# EAGLE schematic Day light emulate for birds unrouted (EAGLE 6.1)
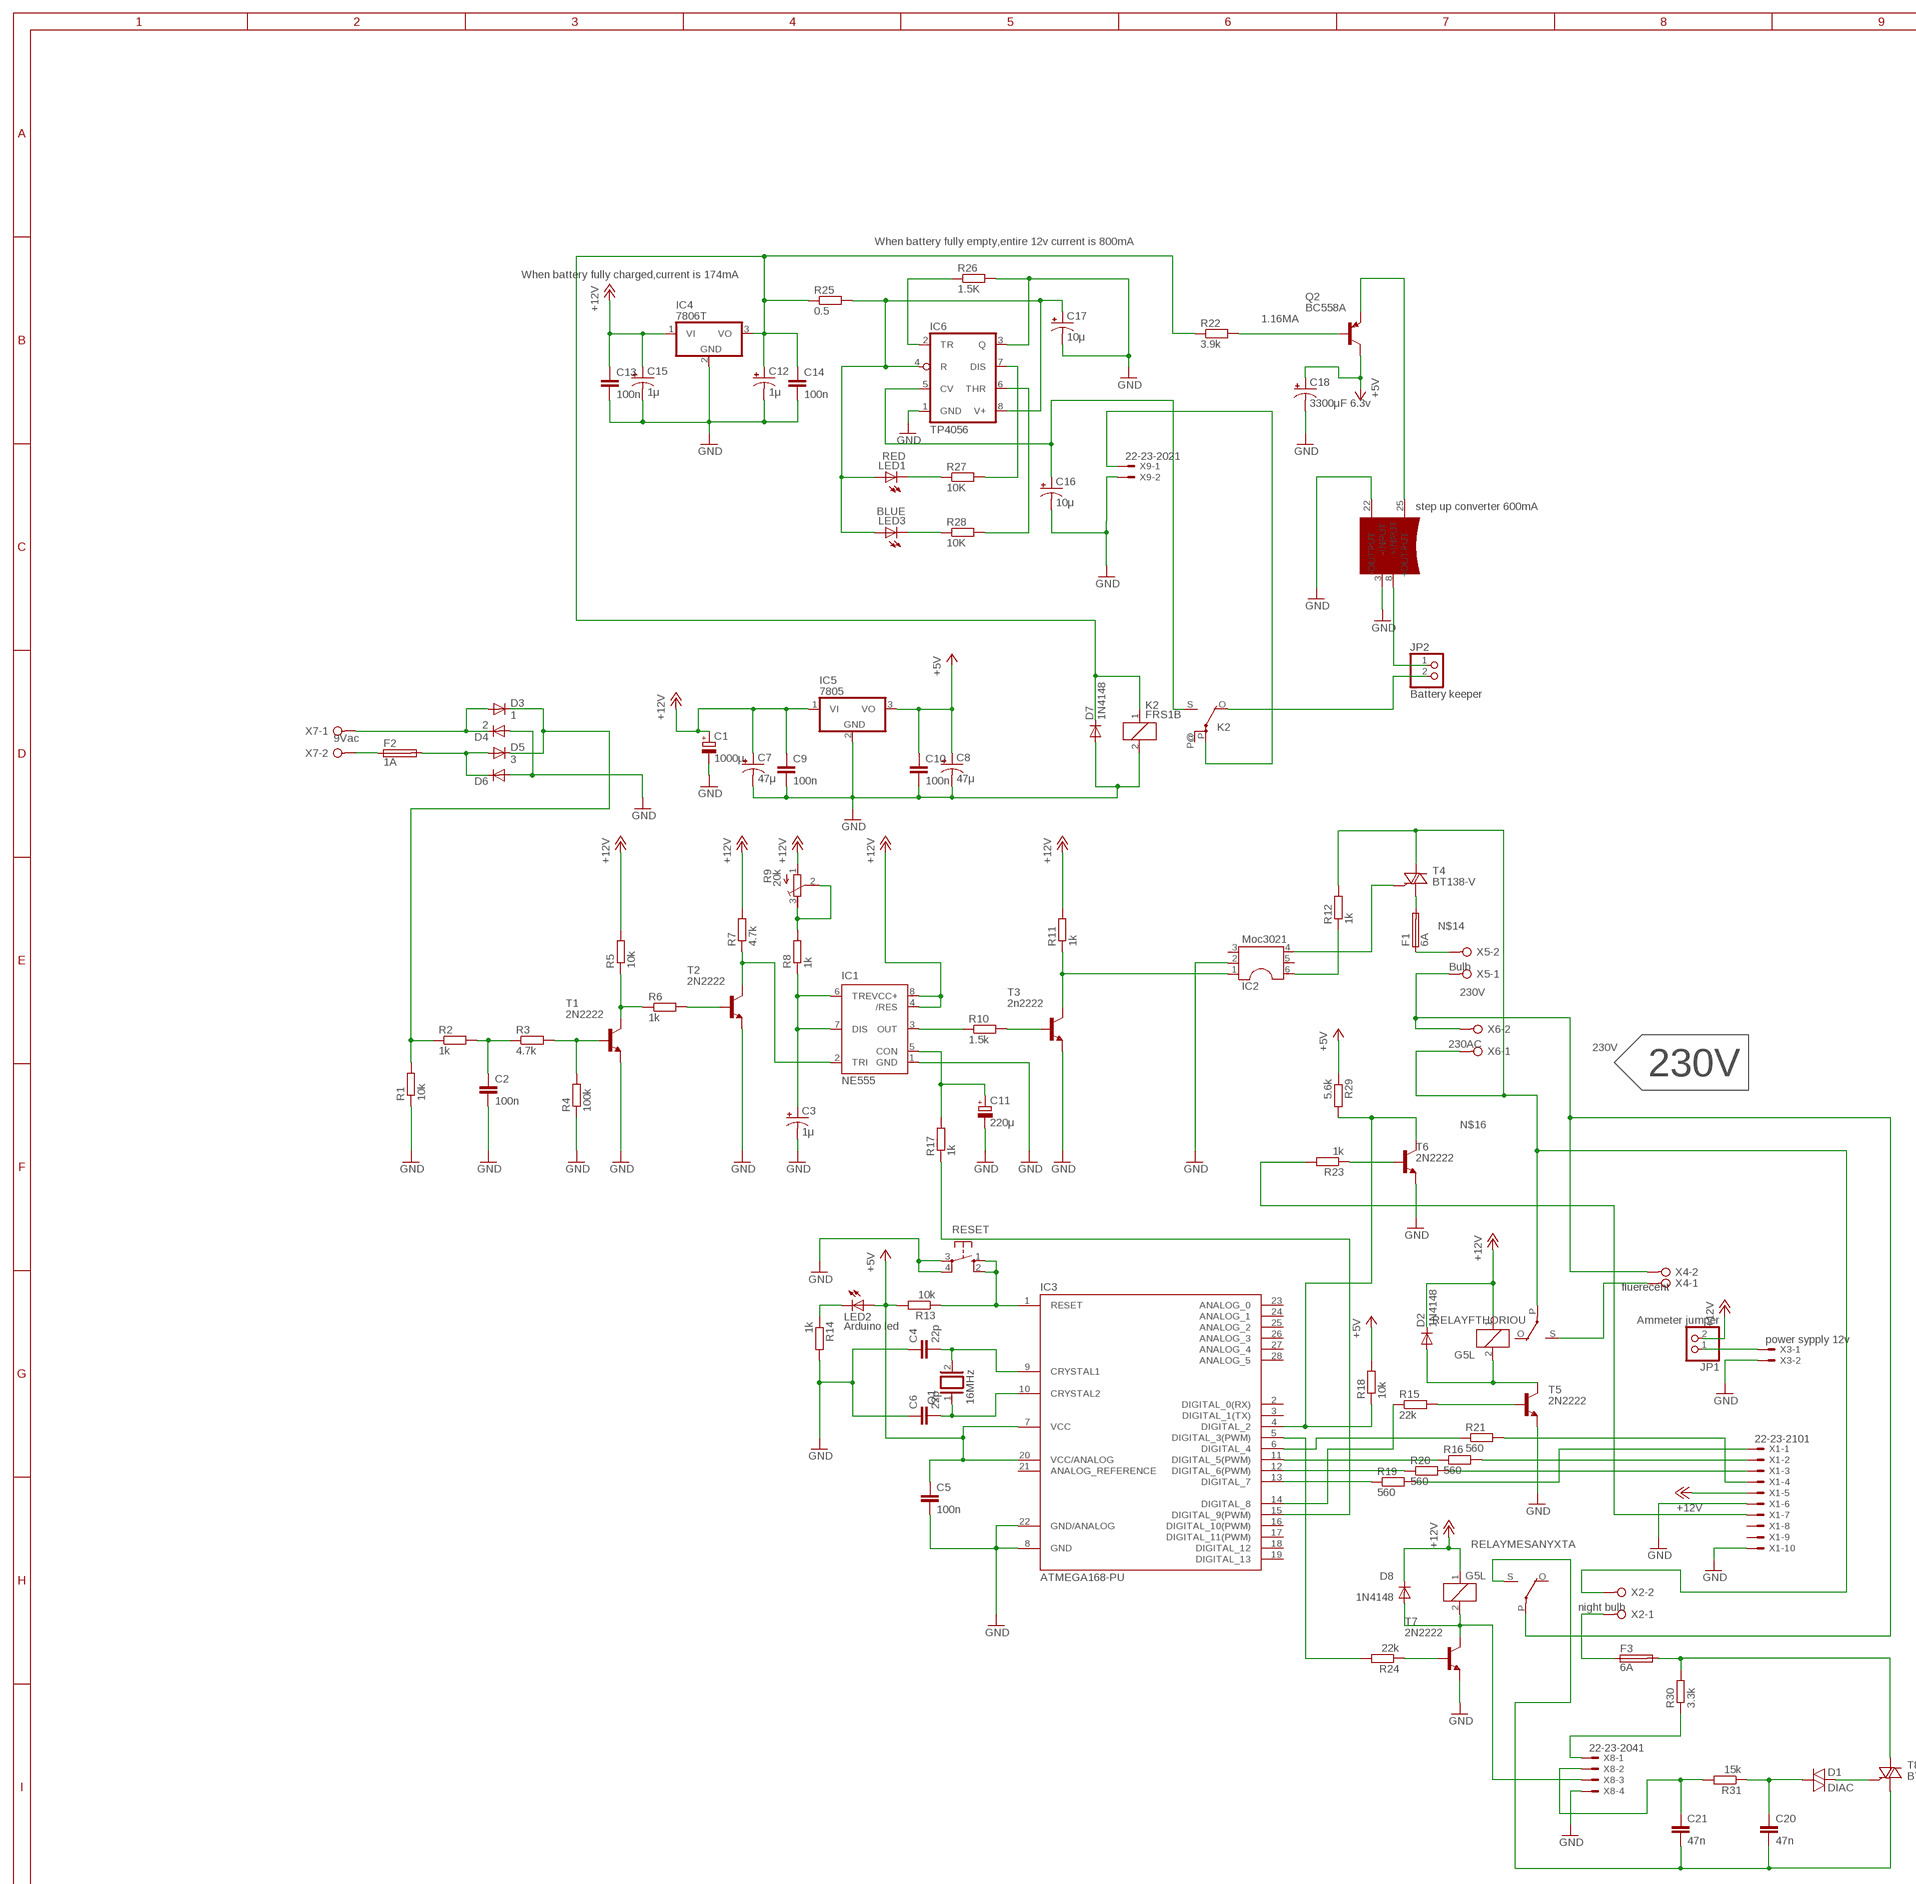
[diagram p0: schematic, sheet 1, part 1 of 2]
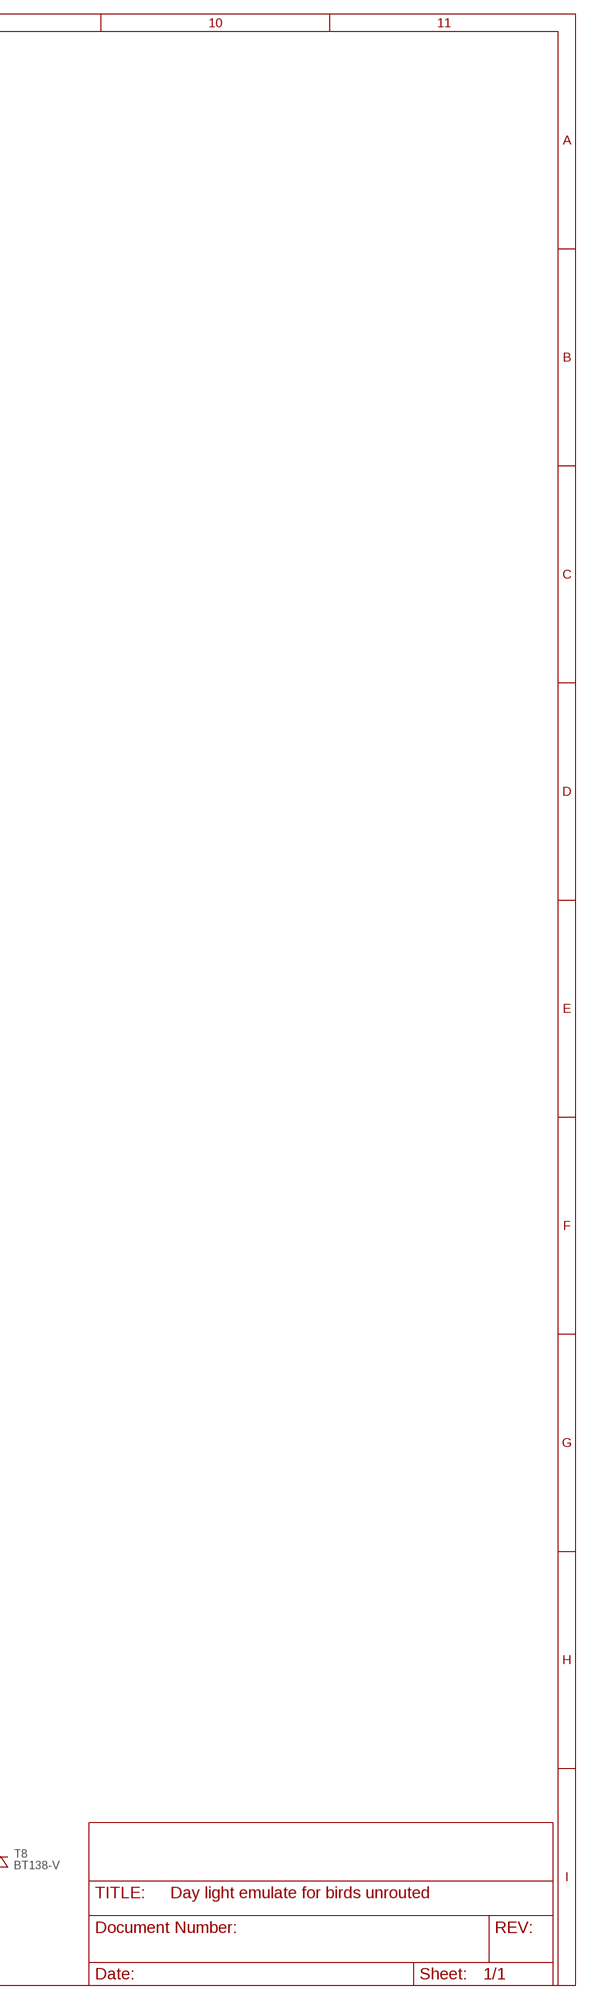
[diagram p1: schematic, sheet 1, part 2 of 2]

## Parts
C1  1000μ  CPOL-EUE5-13  [E5-13]
C2  100n  C-EU025-030X050  [C025-030X050]
C3  1μ  CPOL-USE2-4  [E2-4]
C4  22p  C-EU025-030X050  [C025-030X050]
C5  100n  C-EU025-030X050  [C025-030X050]
C6  22p  C-EU025-030X050  [C025-030X050]
C7  47μ  CPOL-USE2-4  [E2-4]
C8  47μ  CPOL-USE2-4  [E2-4]
C9  100n  C-EU025-030X050  [C025-030X050]
C10  100n  C-EU025-030X050  [C025-030X050]
C11  220μ  CPOL-EUE5-10.5  [E5-10,5]
C12  1μ  CPOL-USE2-4  [E2-4]
C13  100n  C-EU025-030X050  [C025-030X050]
C14  100n  C-EU025-030X050  [C025-030X050]
C15  1μ  CPOL-USE2-4  [E2-4]
C16  10μ  CPOL-USE2-4  [E2-4]
C17  10μ  CPOL-USE2-4  [E2-4]
C18  3300μF 6.3v  CPOL-USE5-6  [E5-6]
C20  47n  C-EU025-030X050  [C025-030X050]
C21  47n  C-EU025-030X050  [C025-030X050]
D1  DIAC  DIAC-GT32  [GT32]
D2  1N4148  [DO35-10]
D3  1  1N4004  [DO41-10]
D4  2  1N4004  [DO41-10]
D5  3  1N4004  [DO41-10]
D6  1N4004  [DO41-10]
D7  1N4148  [DO35-10]
D8  1N4148  [DO35-10]
F1  6A  FUSESHK20L  [SHK20L]
F2  1A  FUSESHK20L  [SHK20L]
F3  6A  FUSESHK20L  [SHK20L]
IC1  NE555  [DIL-08]
IC2  Moc3021  DIL6  [DIL06]
IC3  ATMEGA168-PU  [DIL28-3]
IC4  7806T  [TO220H]
IC5  7805  7805TV  [TO220V]
IC6  TP4056  LM555D  [SO08]
JP1  Ammeter jumper  PINHD-1X2  [1X02]
JP2  Battery keeper  PINHD-1X2  [1X02]
K2  FRS1B  [FRS1B]
LED1  RED  LED3MM  [LED3MM]
LED2  Arduino led  LED3MM  [LED3MM]
LED3  BLUE  LED3MM  [LED3MM]
Q1  16MHz  XTAL/S  [QS]
Q2  BC558A  [TO92-EBC]
R1  10k  R-EU_0207/10  [0207/10]
R2  1k  R-EU_0207/10  [0207/10]
R3  4.7k  R-EU_0207/10  [0207/10]
R4  100k  R-EU_0207/10  [0207/10]
R5  10k  R-EU_0207/10  [0207/10]
R6  1k  R-EU_0207/10  [0207/10]
R7  4.7k  R-EU_0207/10  [0207/10]
R8  1k  R-EU_0207/10  [0207/10]
R9  20k  R-TRIMM3339P  [RTRIM3339P]
R10  1.5k  R-EU_0207/10  [0207/10]
R11  1k  R-EU_0207/10  [0207/10]
R12  1k  R-EU_0207/10  [0207/10]
R13  10k  R-EU_0207/10  [0207/10]
R14  1k  R-EU_0207/10  [0207/10]
R15  22k  R-EU_0207/10  [0207/10]
R16  560  R-EU_0207/10  [0207/10]
R17  1k  R-EU_0207/10  [0207/10]
R18  10k  R-EU_0207/10  [0207/10]
R19  560  R-EU_0207/10  [0207/10]
R20  560  R-EU_0207/10  [0207/10]
R21  560  R-EU_0207/10  [0207/10]
R22  3.9k  R-EU_0207/10  [0207/10]
R23  1k  R-EU_0207/10  [0207/10]
R24  22k  R-EU_0207/10  [0207/10]
R25  0.5  R-EU_0207/10  [0207/10]
R26  1.5K  R-EU_0207/10  [0207/10]
R27  10K  R-EU_0207/10  [0207/10]
R28  10K  R-EU_0207/10  [0207/10]
R29  5.6k  R-EU_0207/10  [0207/10]
R30  3.3k  R-EU_0207/10  [0207/10]
R31  15k  R-EU_0207/10  [0207/10]
RELAYFTHORIOU  G5L  [G5LE]
RELAYMESANYXTA  G5L  [G5LE]
RESET  10-XX  [B3F-10XX]
STEPUP1  steup converter 600mA  STEP_UP_CONVERTER_600MA  [STEPUP_CONVERTER_600MA]
T1  2N2222  [TO18]
T2  2N2222  [TO18]
T3  2n2222  2N2222  [TO18]
T4  BT138-V  [TO220BV]
T5  2N2222  [TO18]
T6  2N2222  [TO18]
T7  2N2222  [TO18]
T8  BT138-V  [TO220BV]
X1  22-23-2101  [22-23-2101]
X2  night bulb  W237-02P  [W237-132]
X3  power sypply 12v  22-23-2021  [22-23-2021]
X4  fluerecent  W237-02P  [W237-132]
X5  Bulb  W237-02P  [W237-132]
X6  230AC  W237-02P  [W237-132]
X7  9Vac  W237-02P  [W237-132]
X8  22-23-2041  [22-23-2041]
X9  22-23-2021  [22-23-2021]

## Nets
1.16MA: Q2.B R22.2
230V: RELAYMESANYXTA.P(2:P) X4.2 X5.1 X6.2
+5V: C5.1 C8.+ C10.1 C18.+ IC3.7(VCC) IC3.20(VCC/ANALOG) IC5.3(VO) LED2.A Q2.C R13.2 R18.2 R29.1
+12V: C1.+ C7.+ C9.1 C13.1 C15.+ D2.C D8.C IC1.4(/RES) IC1.8(VCC+) IC4.1(VI) IC5.1(VI) JP1.2 R5.2 R7.2 R9.1(E) R11.2 RELAYFTHORIOU.1 RELAYMESANYXTA.1 X1.5
GND: C1.- C2.2 C3.- C4.1 C5.2 C6.1 C7.- C8.- C9.2 C10.2 C11.- C12.- C13.2 C14.2 C15.- C16.- C17.- C18.- D4.A D6.A D7.A IC1.1(GND) IC2.2 IC3.8(GND) IC3.22(GND/ANALOG) IC4.2(GND) IC5.2(GND) IC6.1(GND) IC6.3(Q) K2.2 R1.1 R4.1 R14.2 R26.2 RESET.3(P) RESET.4(P1) STEPUP1.3(-INPUT) STEPUP1.22(-OUTPUT) T1.1(E) T2.1(E) T3.1(E) T5.1(E) T6.1(E) T7.1(E) X1.6 X1.10 X3.2 X8.4 X9.2
MORNING: R19.2 X1.1
N$1: IC3.11(DIGITAL_5(PWM)) R16.1
N$2: C2.1 R2.2 R3.1
N$3: R3.2 R4.2 T1.2(B)
N$4: R5.1 R6.1 T1.3(C)
N$5: R6.2 T2.2(B)
N$6: IC1.2(TRI) R7.1 T2.3(C)
N$7: R8.2 R9.2(S) R9.3(A)
N$8: IC1.3(OUT) R10.1
N$9: C3.+ IC1.6(TRE) IC1.7(DIS) R8.1
N$10: R10.2 T3.2(B)
N$11: IC2.1 R11.1 T3.3(C)
N$12: IC2.6 R12.1
N$13: IC2.4 T4.G
N$14: F1.1A X5.2
N$15: JP2.1 STEPUP1.8(+INPUT)
N$16 [230v]: R12.2 RELAYFTHORIOU.P(2:P) T4.T2(A2) X2.2 X6.1
N$17: F2.1A X7.2
N$18: IC3.1(RESET) R13.1 RESET.1(S) RESET.2(S1)
N$19: LED2.K(C) R14.1
N$20: D1.2 T8.G
N$21: C6.2 IC3.10(CRYSTAL2) Q1.1
N$22: C4.2 IC3.9(CRYSTAL1) Q1.2
N$23: IC3.14(DIGITAL_8) R15.1
N$24: R15.2 T5.2(B)
N$25: D2.A RELAYFTHORIOU.2 T5.3(C)
N$26: IC3.13(DIGITAL_7) R19.1
N$27: C11.+ IC1.5(CON) R17.2
N$28: R16.2 X1.2
N$29: IC3.15(DIGITAL_9(PWM)) R17.1
N$30: IC3.6(DIGITAL_4) R21.1
N$31: R21.2 X1.4
N$32: RELAYFTHORIOU.S(2:S) X4.1
N$33: IC3.12(DIGITAL_6(PWM)) R20.1
N$34: D3.A D4.C X7.1
N$35: D5.A D6.C F2.2A
N$36: D3.C D5.C R1.2 R2.1
N$37: R20.2 X1.3
N$38: K2.P(2:P) X9.1
N$39: JP2.2 K2.O(2:O)
N$40: C12.+ C14.1 D7.C IC4.3(VO) K2.1 R22.1 R25.1
N$41: IC3.5(DIGITAL_3(PWM)) R24.2
N$42: R24.1 T7.2(B)
N$43: D8.A RELAYMESANYXTA.2 T7.3(C) X8.3
N$44: C20.2 C21.2 RELAYMESANYXTA.S(2:S) T8.T1(A1)
N$45: Q2.E STEPUP1.25(+OUTPUT)
N$46: C17.+ IC6.4(R) IC6.8(V+) LED1.A LED3.A R25.2
N$47: IC6.7(DIS) R27.2
N$48: IC6.6(THR) R28.2
N$49: C16.+ IC6.5(CV) K2.S(2:S)
N$50: LED1.K(C) R27.1
N$51: IC6.2(TR) R26.1
N$52: LED3.K(C) R28.1
N$53: JP1.1 X3.1
N$54: R23.2 X1.7
N$55: R23.1 T6.2(B)
N$56: IC3.4(DIGITAL_2) R18.1 R29.2 T6.3(C)
N$57: C20.1 D1.1 R31.1
N$58: C21.1 R31.2 X8.2
N$59: R30.1 X8.1
N$60: F3.1A X2.1
N$61: F3.2A R30.2 T8.T2(A2)
N$62: F1.2A T4.T1(A1)
Unconnected: IC2.3 IC2.5 IC3.2(DIGITAL_0(RX)) IC3.3(DIGITAL_1(TX)) IC3.16(DIGITAL_10(PWM)) IC3.17(DIGITAL_11(PWM)) IC3.18(DIGITAL_12) IC3.19(DIGITAL_13) IC3.21(ANALOG_REFERENCE) IC3.23(ANALOG_0) IC3.24(ANALOG_1) IC3.25(ANALOG_2) IC3.26(ANALOG_3) IC3.27(ANALOG_4) IC3.28(ANALOG_5) K2.P@(2:P) RELAYFTHORIOU.O(2:O) RELAYMESANYXTA.O(2:O) X1.8 X1.9

## Library data of the parts
C1 C11 = rcl:CPOL-EU: POLARIZED CAPACITOR, European symbol
C2 C4-C6 C9 C10 C13 C14 C20 C21 = rcl:C-EU: CAPACITOR, European symbol
C3 C7 C8 C12 C15-C18 = rcl:CPOL-US: POLARIZED CAPACITOR, American symbol
D1 = diode:DIAC-: DIAC
D2 D7 D8 = diode:1N4148: DIODE high speed (Philips)
D3-D6 = diode:1N4004: DIODE general purpose rectifier, 1 A
F1-F3 = fuse:FUSE: Fuse
IC1 = st-microelectronics:NE555: General purpose bipolar Timer
IC2 = ic-package:DIL6: Dual In Line / Socket
IC3 = Arduino-AVR:ATMEGA168-PU
IC4 IC5 = linear:78*: Positive VOLTAGE REGULATOR Source: http://cache.national.com/ds/LM/LM78L05.pdf http://www.fairchildsemi.com/ds/LM/LM7805.pdf
IC6 = adafruit:*555: TIMER Changed DIP package to have round (not oval) pin pads http://www.ladyada.net/library/pcb/eaglelibrary.html
JP1 JP2 = pinhead:PINHD-1X2: PIN HEADER
K2 = relay:FRS1B: RELAY 1 x switch, same as V23101-D6-A201, Siemens
LED1 LED3 = adafruit:LED: LED
LED2 = led:LED: LED
Q1 = special:XTAL/S: CRYSTAL
Q2 = transistor-pnp:BC558*: PNP Transistror
R1-R8 R10-R25 R27-R31 = rcl:R-EU_: RESISTOR, European symbol
R9 = resistor:R-TRIMM: Trimm resistor
R26 = rcl:R-EU_: RESISTOR, European symbol; CURRENT: When battery fully empty,entire 12v current is 800mA
RELAYFTHORIOU RELAYMESANYXTA = relay:G5L: RELAY 1 x switch, 10 A/120 V AC, 8 A/30 V ADC, Omron
RESET = switch-omron:10-XX: OMRON SWITCH
STEPUP1 = Step up converter 600mA:STEP_UP_CONVERTER_600MA; STEPUP: step up converter 600mA
T1-T3 T5-T7 = transistor:2N2222: NPN TRANSISTOR
T4 T8 = triac:BT138: TRIAC Source: http://www.semiconductors.philips.com BT138_SERIES_2.pdf
X1 = con-molex:22-23-2101: .100" (2.54mm) Center Header - 10 Pin
X2 X4-X7 = con-wago-508:W237-02P: WAGO SREW CLAMP; OC_FARNELL: unknown; OC_NEWARK: unknown
X3 X9 = con-molex:22-23-2021: .100" (2.54mm) Center Header - 2 Pin
X8 = con-molex:22-23-2041: .100" (2.54mm) Center Header - 4 Pin

## Net classes
0 default: width 0.038 mm
1 230v: width 1.016 mm